# Altium project BEAGLEBONEBLACK_REV A5B.PrjPcb (part 2 of 2)

## Sheet P06_LED, Config, & Button.SchDoc
size 386 x 246 mm
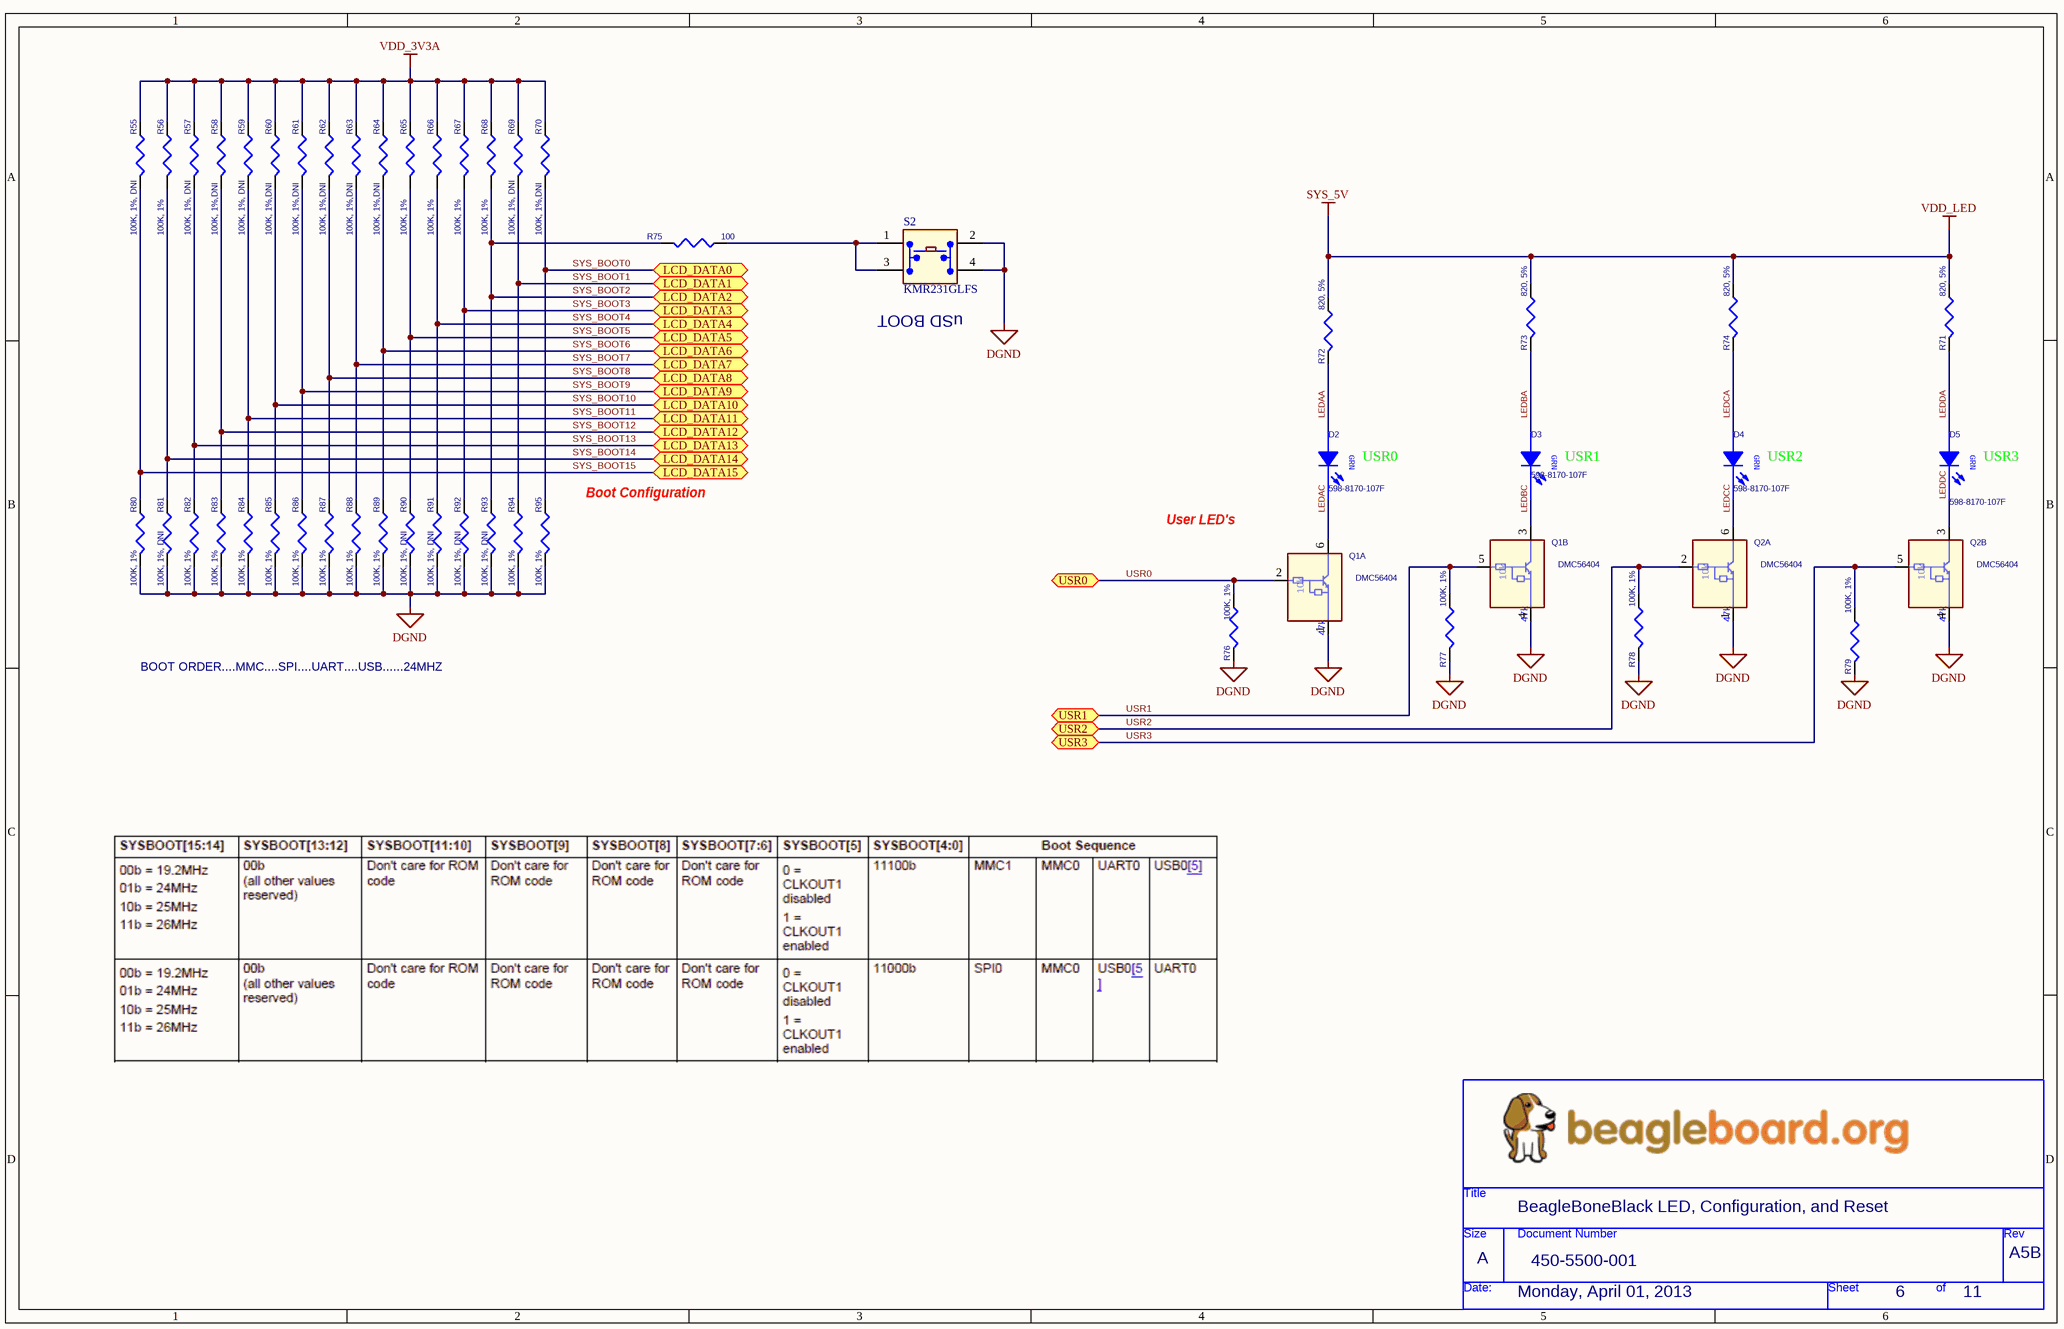
[diagram p2: P06_LED, Config, & Button.SchDoc]

### Parts
(Parts that share a designator on the sheet are numbered #1, #2 ... from top to bottom, then left to right.)
*#3  Page Create Date: Monday, April 01, 2013  Doc: 450-5500-001  RevCode: A5B  Title: BeagleBoneBlack LED, Configuration, and Reset  Page Size: A  Page Number: 6  Page Count: 11  (hidden comment: BeagleBoard_org)  (graphical)
D2  598-8170-107F  [LED_0603]
D3  598-8170-107F  [LED_0603]
D4  598-8170-107F  [LED_0603]
D5  598-8170-107F  [LED_0603]
Q1  DMC56404  [SMini6-F3-B]  (parts A,B of 2)
Q2  DMC56404  [SMini6-F3-B]  (parts A,B of 2)
R55  100K, 1%, DNI  [402]
R56  100K, 1%  [402]
R57  100K, 1%, DNI  [402]
R58  100K, 1%,DNI  [402]
R59  100K, 1%, DNI  [402]
R60  100K, 1%,DNI  [402]
R61  100K, 1%,DNI  [402]
R62  100K, 1%,DNI  [402]
R63  100K, 1%,DNI  [402]
R64  100K, 1%,DNI  [402]
R65  100K, 1%  [402]
R66  100K, 1%  [402]
R67  100K, 1%  [402]
R68  100K, 1%  [402]
R69  100K, 1%, DNI  [402]
R70  100K, 1%,DNI  [402]
R71  820, 5%  [402]
R72  820, 5%  [402]
R73  820, 5%  [402]
R74  820, 5%  [402]
R75  100  [402]
R76  100K, 1%  [402]
R77  100K, 1%  [402]
R78  100K, 1%  [402]
R79  100K, 1%  [402]
R80  100K, 1%  [402]
R81  100K, 1%, DNI  [402]
R82  100K, 1%  [402]
R83  100K, 1%  [402]
R84  100K, 1%  [402]
R85  100K, 1%  [402]
R86  100K, 1%  [402]
R87  100K, 1%  [402]
R88  100K, 1%  [402]
R89  100K, 1%  [402]
R90  100K, 1%, DNI  [402]
R91  100K, 1%, DNI  [402]
R92  100K, 1%, DNI  [402]
R93  100K, 1%, DNI  [402]
R94  100K, 1%  [402]
R95  100K, 1%  [402]
S2  KMR231GLFS  [SW4SMD_63X161LS]

### Ports
LCD_DATA0, LCD_DATA1, LCD_DATA2, LCD_DATA3, LCD_DATA4, LCD_DATA5, LCD_DATA6, LCD_DATA7, LCD_DATA8, LCD_DATA9, LCD_DATA10, LCD_DATA11, LCD_DATA12, LCD_DATA13, LCD_DATA14, LCD_DATA15, USR0, USR1, USR2, USR3

### Nets
DGND: Q1.1 Q1.4 Q2.1 Q2.4 R76.2 R77.2 R78.2 R79.2 R80.2 R81.2 R82.2 R83.2 R84.2 R85.2 R86.2 R87.2 R88.2 R89.2 R90.2 R91.2 R92.2 R93.2 R94.2 R95.2 S2.2(A2) S2.4
SYS_5V: R71.1 R72.1 R73.1 R74.1  [also labelled VDD_LED]
VDD_3V3A: R55.1 R56.1 R57.1 R58.1 R59.1 R60.1 R61.1 R62.1 R63.1 R64.1 R65.1 R66.1 R67.1 R68.1 R69.1 R70.1
LEDAA: D2.2(A) R72.2
LEDAC: D2.1(C) Q1.6
LEDBA: D3.2(A) R73.2
LEDBC: D3.1(C) Q1.3
LEDCA: D4.2(A) R74.2
LEDCC: D4.1(C) Q2.6
LEDDA: D5.2(A) R71.2
LEDDC: D5.1(C) Q2.3
SYS_BOOT0: R70.2 R95.1 ; port LCD_DATA0
SYS_BOOT1: R69.2 R94.1 ; port LCD_DATA1
SYS_BOOT2: R68.2 R75.1(P1) R93.1 ; port LCD_DATA2
SYS_BOOT3: R67.2 R92.1 ; port LCD_DATA3
SYS_BOOT4: R66.2 R91.1 ; port LCD_DATA4
SYS_BOOT5: R65.2 R90.1 ; port LCD_DATA5
SYS_BOOT6: R64.2 R89.1 ; port LCD_DATA6
SYS_BOOT7: R63.2 R88.1 ; port LCD_DATA7
SYS_BOOT8: R62.2 R87.1 ; port LCD_DATA8
SYS_BOOT9: R61.2 R86.1 ; port LCD_DATA9
SYS_BOOT10: R60.2 R85.1 ; port LCD_DATA10
SYS_BOOT11: R59.2 R84.1 ; port LCD_DATA11
SYS_BOOT12: R58.2 R83.1 ; port LCD_DATA12
SYS_BOOT13: R57.2 R82.1 ; port LCD_DATA13
SYS_BOOT14: R56.2 R81.1 ; port LCD_DATA14
SYS_BOOT15: R55.2 R80.1 ; port LCD_DATA15
USR0: Q1.2 R76.1 ; port USR0
USR1: Q1.5 R77.1 ; port USR1
USR2: Q2.2 R78.1 ; port USR2
USR3: Q2.5 R79.1 ; port USR3
NetR75_2: R75.2(P2) S2.1(A1) S2.3(A3)

### Notes on the sheet
- (near S2) uSD BOOT
- (near D2) USR0
- (near D3) USR1
- (near D4) USR2
- (near D5) USR3
- (near R95) Boot Configuration
- User LED's
- BOOT ORDER....MMC....SPI....UART....USB......24MHZ
- (in symbol BeagleBoard_org) Title; Size; Document Number; Rev; Date:; Sheet; of
- (in symbol LED_LTST-C150GKT) GRN

### Library data of the parts
D2-D5 = LED_LTST-C150GKT: LED GREEN CLEAR 0805 SMD; Manufacturer: Lite-On Inc; Manufacturer Part Number: LTST-C170KGKT; CLASS: DISCRETE; TN: 257-0020-000; Current - Test: 20mA; Lens Style/Size: Rectangle with Flat Top, 1.4mm x 1.25mm; Millicandela Rating: 35mcd; Viewing Angle: 130°; Voltage - Forward (Vf) Typ: 2V; Wavelength - Dominant: 571nm; Wavelength - Peak: 574nm; Category: Optoelectronics; Color: Green; ComponentLink1Description: http://optoelectronics.liteon.com/en-us/api/DwonloadFileHandler.ashx?txtSpecNo=DS22-2000-073&txtPartNo=LTST-C170KGKT; ComponentLink1URL: http://optoelectronics.liteon.com/en-us/api/DwonloadFileHandler.ashx?txtSpecNo=DS22-2000-073&txtPartNo=LTST-C170KGKT; Height: 1.10mm; Lens Type: Clear; Luminous Flux @ Current - Test: -; Mounting Type: Surface Mount; Package / Case: 0805 (2012 Metric); Packaging: Digi-Reel®; Pricing 1: 1=0.37, 10=0.267, 100=0.1574, 250=0.11136, 500=0.09504, 1000=0.07425 (USD); RoHS: RoHS Compliant; Size / Dimension: 2.00mm L x 1.25mm W; Stock 1: 274890; Supplier 1: Digi-Key; Supplier Part Number 1: 160-1414-6-ND
Q1 Q2 = RN1907: TRANS PREBIASED DUAL NPN SOT363; Manufacturer: Toshiba; Manufacturer Part Number: DDC114YU-7-F; Order# 2: BCR135S; ATLStockNo1: 2130.0137; ATLStockNo2: 2130.01; Transistor Type: 2 NPN - Pre-Biased (Dual); Current - Collector (Ic) (Max): 100mA; Voltage - Collector Emitter Breakdown (Max): 50V; Resistor - Base (R1) (Ohms): 10k; Resistor - Emitter Base (R2) (Ohms): 47k; DC Current Gain (hFE) (Min) @ Ic, Vce: 68 @ 10mA, 5V; Vce Saturation (Max) @ Ib, Ic: 300mV @ 250µA, 5mA; Current - Collector Cutoff (Max): 500nA; Frequency - Transition: 250MHz; Power - Max: 200mW; Supplier 1: Digi-Key; Supplier Part Number 1: DDC114YU-FDIDKR-ND; RoHS: RoHS Compliant; Category: Discrete Semiconductor Products; Stock 1: 11411; Pricing 1: 1=0.46, 10=0.334, 25=0.2596, 100=0.1966, 250=0.13896, 500=0.11124, 1000=0.08532 (USD); Mounting Type: Surface Mount; Package / Case: 6-TSSOP, SC-88, SOT-363; Supplier Device Package: SOT-363; Packaging: Digi-Reel®; ComponentLink1URL: http://www.diodes.com/datasheets/ds30345.pdf; ComponentLink1Description: http://www.diodes.com/datasheets/ds30345.pdf
R55-R70 R76-R95 = RES_100K_1/16W_1%_0402: RES 100K OHM 1/16W 1% 0402 SMD; Manufacturer: Stackpole Electronics Inc; Manufacturer Part Number: RMCF0402FT100K; Power (Watts): 0.063W, 1/16W; Temperature Coefficient: ±100ppm/°C; Category: Resistors; ComponentLink1Description: http://www.seielect.com/Catalog/SEI-RMCF_RMCP.pdf; ComponentLink1URL: http://www.seielect.com/Catalog/SEI-RMCF_RMCP.pdf; Composition: Thick Film; Features: -; Height: 0.016" (0.40mm); Number of Terminations: 2; Package / Case: 0402 (1005 Metric); Packaging: Digi-Reel®; Pricing 1: 1=0.04, 10=0.025, 50=0.0138, 100=0.0105, 250=0.0078, 500=0.00576, 1000=0.00384, 2500=0.00324, 5000=0.0027 (USD); Resistance (Ohms): 100k; RoHS: RoHS Compliant; Size / Dimension: 0.039" L x 0.020" W (1.00mm x 0.50mm); Stock 1: 851196; Supplier 1: Digi-Key; Supplier Device Package: 0402; Supplier Part Number 1: RMCF0402FT100KDKR-ND; Tolerance: ±1%
R71-R74 = RES_470_1/10W_5%_0402: RES 820 OHM 1/10W 5% 0402 SMD; Manufacturer: Yageo; Manufacturer Part Number: RC0402JR-07820RL; Power (Watts): 0.063W, 1/16W; Resistance (Ohms): 820; Temperature Coefficient: ±100ppm/°C; Category: Resistors; ComponentLink1Description: http://www.yageo.com/documents/recent/PYu-RC0402_51_RoHS_L_6.pdf; ComponentLink1URL: http://www.yageo.com/documents/recent/PYu-RC0402_51_RoHS_L_6.pdf; Composition: Thick Film; Features: -; Height: 0.016" (0.40mm); Number of Terminations: 2; Package / Case: 0402 (1005 Metric); Packaging: Digi-Reel®; Pricing 1: 1=0.1, 10=0.012, 25=0.0092, 100=0.0055, 250=0.00476, 500=0.00336, 1000=0.00237, 2500=0.00206, 5000=0.00178 (USD); RoHS: RoHS Compliant; Size / Dimension: 0.039" L x 0.020" W (1.00mm x 0.50mm); Stock 1: 7437; Supplier 1: Digi-Key; Supplier Device Package: 0402; Supplier Part Number 1: 311-820JRDKR-ND; Tolerance: ±5%
R75 = RES SMD: RES 100 OHM 1/10W 5% 0402 SMD; Manufacturer: Panasonic Electronic Components; Manufacturer Part Number: ERJ-2RKF1000X; Power (Watts): 0.1W, 1/10W; Temperature Coefficient: ±100ppm/°C; Category: Resistors; ComponentLink1Description: http://industrial.panasonic.com/www-cgi/jvcr13pz.cgi?E+PZ+3+AOA0002+ERJ2RKF1000X+7+WW; ComponentLink1URL: http://industrial.panasonic.com/www-cgi/jvcr13pz.cgi?E+PZ+3+AOA0002+ERJ2RKF1000X+7+WW; Composition: Thick Film; Features: -; Height: 0.016" (0.40mm); Number of Terminations: 2; Package / Case: 0402 (1005 Metric); Packaging: Digi-Reel®; Pricing 1: 1=0.1, 50=0.0242, 100=0.0184, 250=0.01364, 500=0.01008, 1000=0.00672, 5000=0.00473 (USD); Resistance (Ohms): 100; RoHS: RoHS; Size / Dimension: 0.039" L x 0.020" W (1.00mm x 0.50mm); Stock 1: 2375521; Supplier 1: Digi-Key; Supplier Device Package: 0402; Supplier Part Number 1: P100LDKR-ND
S2 = KMR2: Microminiature Tact Switch for SMT; Manufacturer: C&K Components; Circuit: SPST-NO; Switch Function: Off-Mom; Contact Rating @ Voltage: 0.05A @ 32VDC; Actuator Type: Standard; Actuator Height off PCB, from Pins: 1.90mm; Actuator Orientation: Top Actuated; Outline: 4.60mm x 2.80mm; Illumination: Non-Illuminated; Operating Force: 300gf; Switch Travel: 0.25mm; Mechanical Life: 150,000 Cycles; Supplier 1: Digi-Key; Supplier Part Number 1: 401-1429-6-ND; Manufacturer Part Number: KMR231GLFS; RoHS: RoHS Compliant; Category: Switches; Stock 1: 32289; Pricing 1: 1=0.44, 10=0.416, 25=0.3744, 50=0.3326, 100=0.3188, 250=0.29108, 500=0.2772, 1000=0.22869 (USD); Mounting Type: Surface Mount; Termination Style: Gull Wing; Illumination Voltage (Nominal): -; Illumination Type, Color: -; Ingress Protection: -; Features: Grounding Pin; Packaging: Digi-Reel®; Actuator Material: -; Operating Temperature: -40°C ~ 85°C; ComponentLink1URL: http://www.ck-components.com/index.php?module=media&action=Display&cmpref=14414&lang=en&width=&height=&format=&alt=; ComponentLink1Description: http://www.ck-components.com/index.php?module=media&action=Display&cmpref=14414&lang=en&width=&height=&format=&alt=

## Nets that join several sheets
DGND: P02_Power Management (32 pins), P03_Processor 1 of 3, JTAG Header (20 pins), P06_LED, Config, & Button (26 pins)
SYS_5V: P02_Power Management (14 pins), P06_LED, Config, & Button (R71.1 R72.1 R73.1 R74.1)
VDD_3V3A: P02_Power Management (5 pins), P03_Processor 1 of 3, JTAG Header (9 pins), P06_LED, Config, & Button (16 pins)
VDD_3V3B: P02_Power Management (C20.1 R11.1 U4.3), P03_Processor 1 of 3, JTAG Header (C29.1 P2.5 R23.1 R24.1)
LDO_PGOOD: P02_Power Management (U2.46), P03_Processor 1 of 3, JTAG Header (U5.B5)
PMIC_INT: P02_Power Management (R1.2 U2.45), P03_Processor 1 of 3, JTAG Header (U5.B18)
PMIC_PGOOD: P02_Power Management (U2.26), P03_Processor 1 of 3, JTAG Header (U5.B15)
USR0: P03_Processor 1 of 3, JTAG Header (U5.V15), P06_LED, Config, & Button (Q1.2 R76.1)
USR1: P03_Processor 1 of 3, JTAG Header (U5.U15), P06_LED, Config, & Button (Q1.5 R77.1)
USR2: P03_Processor 1 of 3, JTAG Header (U5.T15), P06_LED, Config, & Button (Q2.2 R78.1)
USR3: P03_Processor 1 of 3, JTAG Header (U5.V16), P06_LED, Config, & Button (Q2.5 R79.1)

## Assembly variants
Default: not fitted C137 C138 C139 C140 P2 R9 R57 R58 R59 R60 R61 R62 R63 R64 R69 R70 R81 R90 R91 R92 R93 R124 R140 R141